# Altium project PCB_BobBreakout.PrjPcb
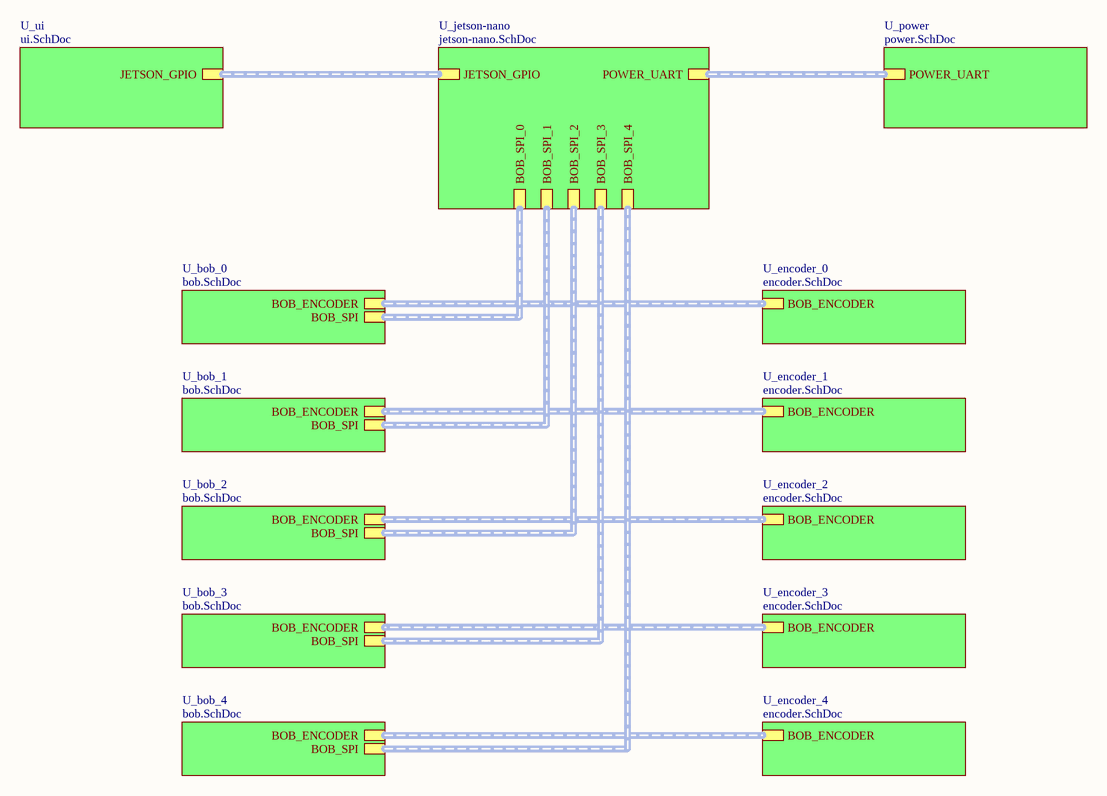
[diagram p0: bob_breakout-top.SchDoc]
8 sheets, 95 parts. Net scope: hierarchical (ports join the sheet entries above them; power ports are global).
Board file: layout.PcbDoc
Sheets:
  bob_breakout-top.SchDoc
    U_jetson-nano = jetson-nano.SchDoc
      U_isolation_0 = isolation.SchDoc
      U_isolation_1 = isolation.SchDoc
      U_isolation_2 = isolation.SchDoc
      U_low-pass-filter_0 = low-pass-filter.SchDoc
      U_low-pass-filter_1 = low-pass-filter.SchDoc
      U_low-pass-filter_2 = low-pass-filter.SchDoc
      U_low-pass-filter_3 = low-pass-filter.SchDoc
      U_low-pass-filter_4 = low-pass-filter.SchDoc
      U_low-pass-filter_5 = low-pass-filter.SchDoc
      U_low-pass-filter_6 = low-pass-filter.SchDoc
      U_low-pass-filter_7 = low-pass-filter.SchDoc
      U_low-pass-filter_8 = low-pass-filter.SchDoc
    U_bob_0 = bob.SchDoc
    U_bob_1 = bob.SchDoc
    U_bob_2 = bob.SchDoc
    U_bob_3 = bob.SchDoc
    U_bob_4 = bob.SchDoc
    U_encoder_0 = encoder.SchDoc
    U_encoder_1 = encoder.SchDoc
    U_encoder_2 = encoder.SchDoc
    U_encoder_3 = encoder.SchDoc
    U_encoder_4 = encoder.SchDoc
    U_power = power.SchDoc
    U_ui = ui.SchDoc

## Sheet bob_breakout-top.SchDoc
size A4; SheetNumber: 1; SheetTotal: 7

### Sub-sheets
U_bob_0 = bob.SchDoc: BOB_ENCODER (harness BOB_ENCODER), BOB_SPI (harness BOB_SPI)
U_bob_1 = bob.SchDoc: BOB_ENCODER (harness BOB_ENCODER), BOB_SPI (harness BOB_SPI)
U_bob_2 = bob.SchDoc: BOB_ENCODER (harness BOB_ENCODER), BOB_SPI (harness BOB_SPI)
U_bob_3 = bob.SchDoc: BOB_ENCODER (harness BOB_ENCODER), BOB_SPI (harness BOB_SPI)
U_bob_4 = bob.SchDoc: BOB_ENCODER (harness BOB_ENCODER), BOB_SPI (harness BOB_SPI)
U_encoder_0 = encoder.SchDoc: BOB_ENCODER (harness BOB_ENCODER)
U_encoder_1 = encoder.SchDoc: BOB_ENCODER (harness BOB_ENCODER)
U_encoder_2 = encoder.SchDoc: BOB_ENCODER (harness BOB_ENCODER)
U_encoder_3 = encoder.SchDoc: BOB_ENCODER (harness BOB_ENCODER)
U_encoder_4 = encoder.SchDoc: BOB_ENCODER (harness BOB_ENCODER)
U_jetson-nano = jetson-nano.SchDoc: BOB_SPI_2 (harness BOB_SPI), BOB_SPI_0 (harness BOB_SPI), BOB_SPI_4 (harness BOB_SPI), BOB_SPI_3 (harness BOB_SPI), BOB_SPI_1 (harness BOB_SPI), JETSON_GPIO (harness JETSON_GPIO), POWER_UART (harness POWER_UART)
U_power = power.SchDoc: POWER_UART (harness POWER_UART)
U_ui = ui.SchDoc: JETSON_GPIO (harness JETSON_GPIO)

### Buses and harness runs
harness sheet U_bob_0/BOB_ENCODER = sheet U_encoder_0/BOB_ENCODER
harness sheet U_bob_0/BOB_SPI = sheet U_jetson-nano/BOB_SPI_0
harness sheet U_bob_1/BOB_ENCODER = sheet U_encoder_1/BOB_ENCODER
harness sheet U_bob_1/BOB_SPI = sheet U_jetson-nano/BOB_SPI_1
harness sheet U_bob_2/BOB_ENCODER = sheet U_encoder_2/BOB_ENCODER
harness sheet U_bob_2/BOB_SPI = sheet U_jetson-nano/BOB_SPI_2
harness sheet U_bob_3/BOB_ENCODER = sheet U_encoder_3/BOB_ENCODER
harness sheet U_bob_3/BOB_SPI = sheet U_jetson-nano/BOB_SPI_3
harness sheet U_bob_4/BOB_ENCODER = sheet U_encoder_4/BOB_ENCODER
harness sheet U_bob_4/BOB_SPI = sheet U_jetson-nano/BOB_SPI_4
harness sheet U_jetson-nano/JETSON_GPIO = sheet U_ui/JETSON_GPIO
harness sheet U_jetson-nano/POWER_UART = sheet U_power/POWER_UART

## Sheet jetson-nano.SchDoc
size A3; SheetNumber: 2; SheetTotal: 8
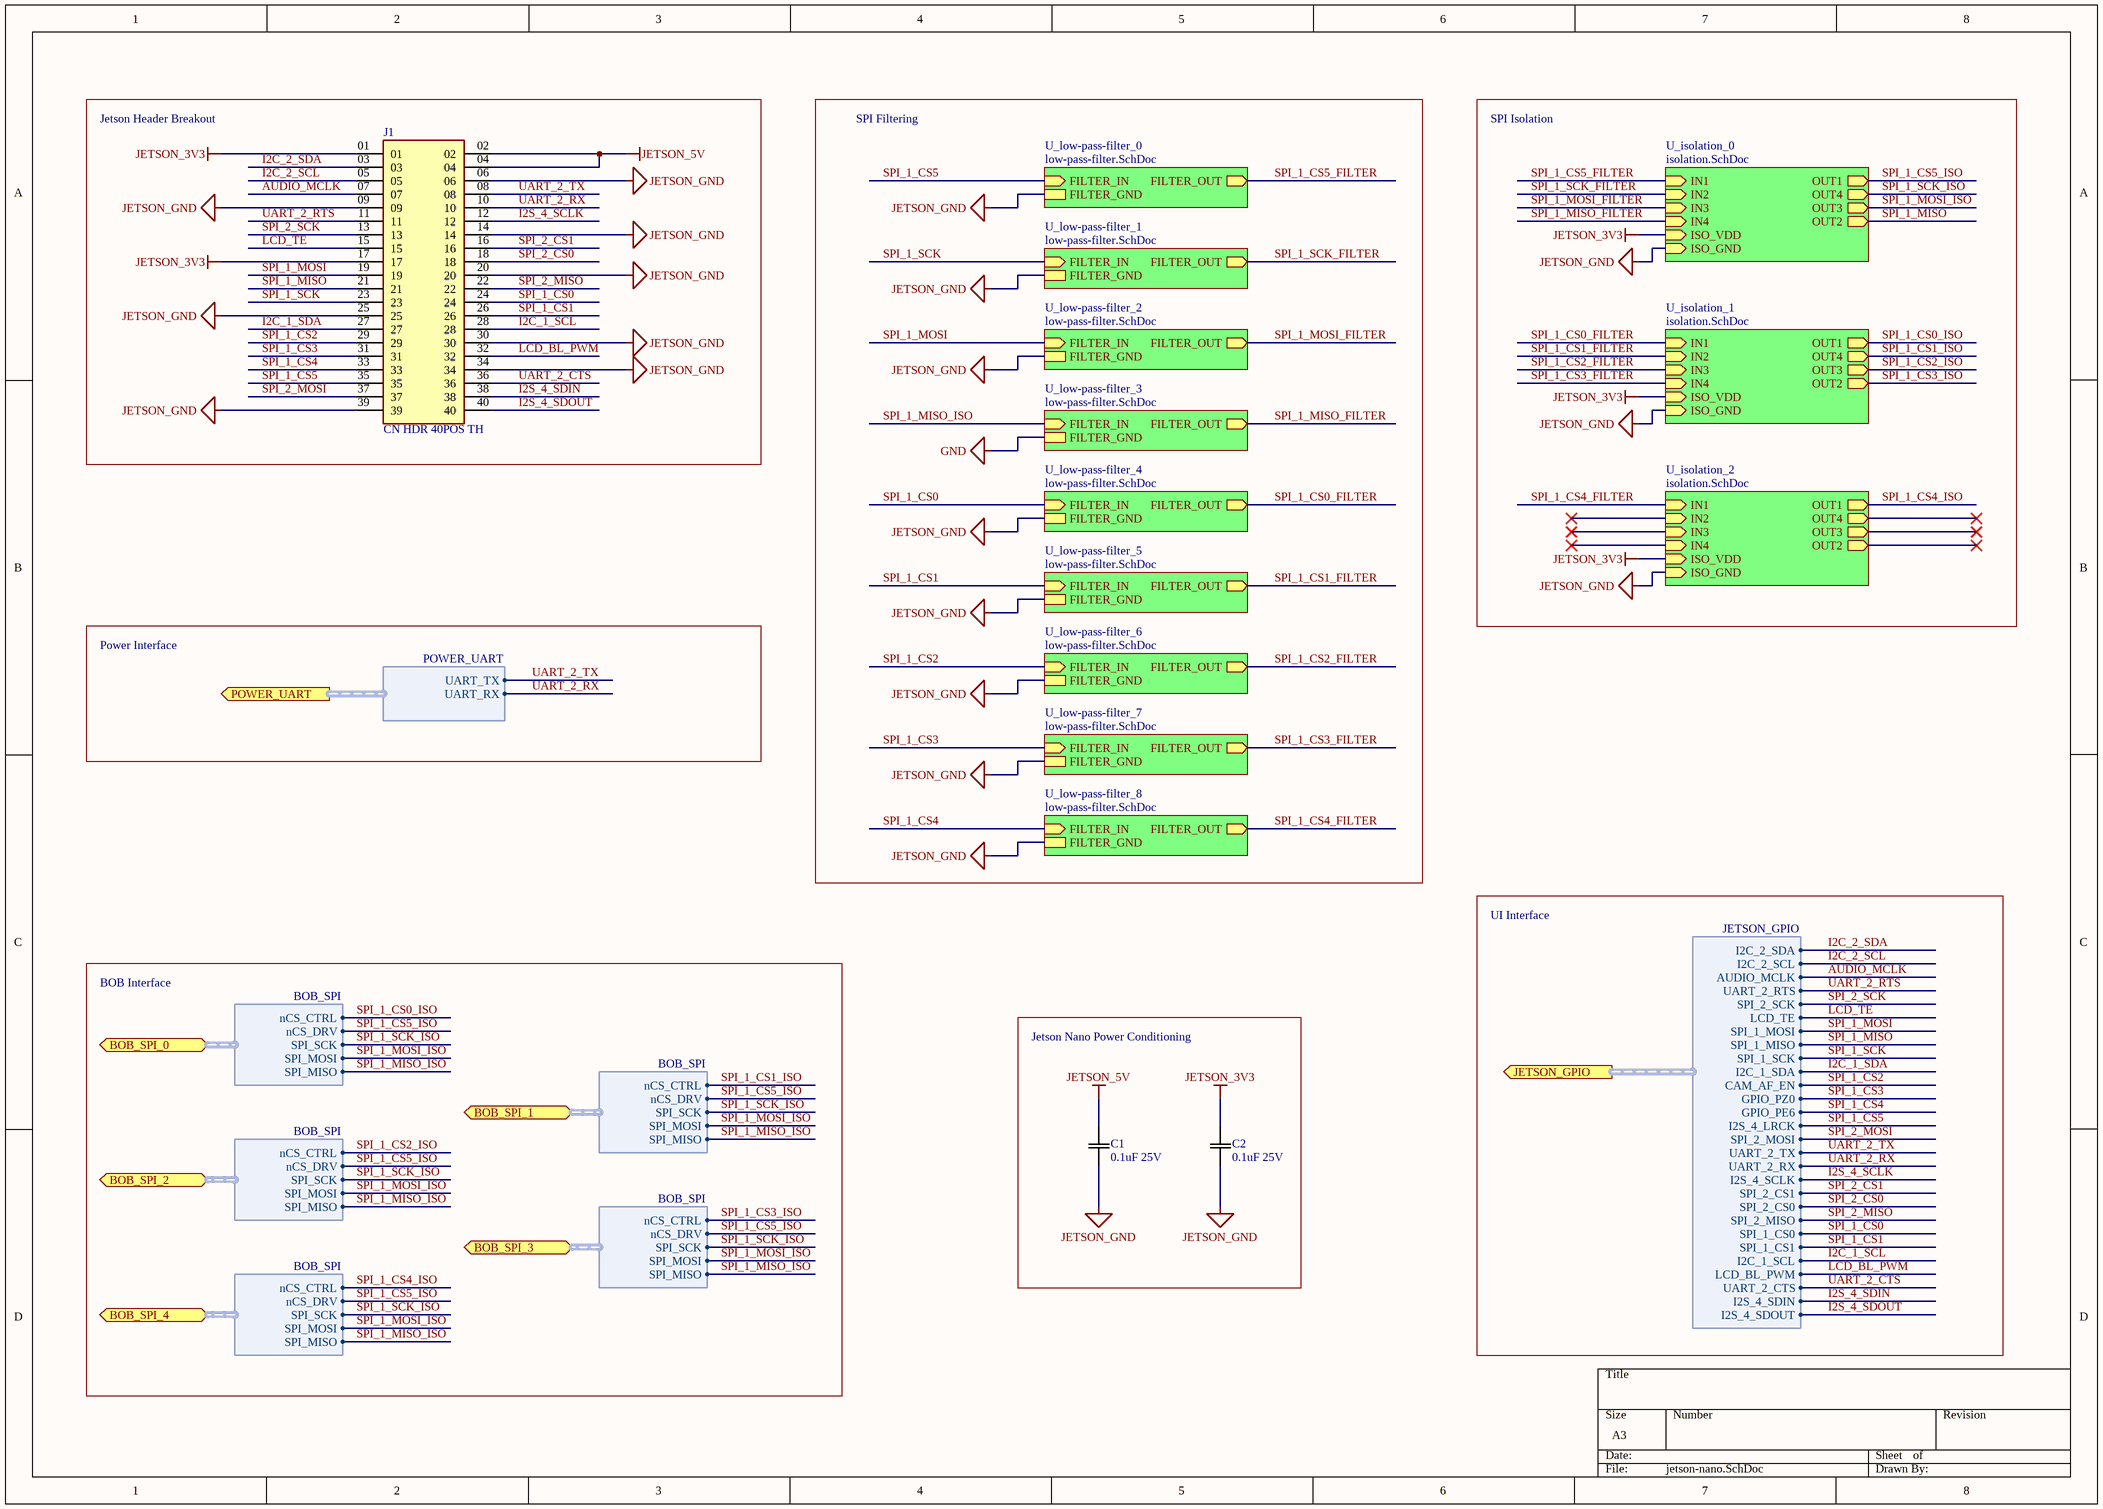
[diagram p1: jetson-nano.SchDoc]

### Parts
C1  0.1uF 25V  [0805]
C2  0.1uF 25V  [0805]
J1  CN HDR 40POS TH  [SAMTEC_SSQ-120-22-G-D]

### Blocks framed on the sheet
Jetson Header Breakout: J1
Jetson Nano Power Conditioning: C1 C2

### Sub-sheets
U_isolation_0 = isolation.SchDoc: OUT1 (out), IN1 (in), IN2 (in), IN3 (in), OUT4 (out), OUT3 (out), OUT2 (out), IN4 (in), ISO_VDD (in), ISO_GND (in)
U_isolation_1 = isolation.SchDoc: OUT1 (out), IN1 (in), IN2 (in), IN3 (in), OUT4 (out), OUT3 (out), OUT2 (out), IN4 (in), ISO_VDD (in), ISO_GND (in)
U_isolation_2 = isolation.SchDoc: OUT1 (out), IN1 (in), IN2 (in), IN3 (in), OUT4 (out), OUT3 (out), OUT2 (out), IN4 (in), ISO_VDD (in), ISO_GND (in)
U_low-pass-filter_0 = low-pass-filter.SchDoc: FILTER_OUT (out), FILTER_IN (in), FILTER_GND
U_low-pass-filter_1 = low-pass-filter.SchDoc: FILTER_OUT (out), FILTER_IN (in), FILTER_GND
U_low-pass-filter_2 = low-pass-filter.SchDoc: FILTER_OUT (out), FILTER_IN (in), FILTER_GND
U_low-pass-filter_3 = low-pass-filter.SchDoc: FILTER_OUT (out), FILTER_IN (in), FILTER_GND
U_low-pass-filter_4 = low-pass-filter.SchDoc: FILTER_OUT (out), FILTER_IN (in), FILTER_GND
U_low-pass-filter_5 = low-pass-filter.SchDoc: FILTER_OUT (out), FILTER_IN (in), FILTER_GND
U_low-pass-filter_6 = low-pass-filter.SchDoc: FILTER_OUT (out), FILTER_IN (in), FILTER_GND
U_low-pass-filter_7 = low-pass-filter.SchDoc: FILTER_OUT (out), FILTER_IN (in), FILTER_GND
U_low-pass-filter_8 = low-pass-filter.SchDoc: FILTER_OUT (out), FILTER_IN (in), FILTER_GND

### Ports
BOB_SPI_0 (bidir, harness BOB_SPI), BOB_SPI_1 (bidir, harness BOB_SPI), BOB_SPI_2 (bidir, harness BOB_SPI), BOB_SPI_3 (bidir, harness BOB_SPI), BOB_SPI_4 (bidir, harness BOB_SPI), JETSON_GPIO (out, harness JETSON_GPIO), POWER_UART (out, harness POWER_UART)

### Harnesses
BOB_SPI: nCS_CTRL, nCS_DRV, SPI_SCK, SPI_MOSI, SPI_MISO
POWER_UART: UART_TX, UART_RX
JETSON_GPIO: I2C_2_SDA, I2C_2_SCL, AUDIO_MCLK, UART_2_RTS, SPI_2_SCK, LCD_TE, SPI_1_MOSI, SPI_1_MISO, SPI_1_SCK, I2C_1_SDA, CAM_AF_EN, GPIO_PZ0, GPIO_PE6, I2S_4_LRCK, SPI_2_MOSI, UART_2_TX, UART_2_RX, I2S_4_SCLK, SPI_2_CS1, SPI_2_CS0, SPI_2_MISO, SPI_1_CS0, SPI_1_CS1, I2C_1_SCL, LCD_BL_PWM, UART_2_CTS, I2S_4_SDIN, I2S_4_SDOUT

### Nets
JETSON_3V3: C2.1(C1) J1.01 J1.17 ; sheet U_isolation_0/ISO_VDD, sheet U_isolation_1/ISO_VDD, sheet U_isolation_2/ISO_VDD
JETSON_5V: C1.1(C1) J1.02 J1.04
JETSON_GND: C1.2(C2) C2.2(C2) J1.06 J1.09 J1.14 J1.20 J1.25 J1.30 J1.34 J1.39 ; sheet U_isolation_0/ISO_GND, sheet U_isolation_1/ISO_GND, sheet U_isolation_2/ISO_GND, sheet U_low-pass-filter_0/FILTER_GND, sheet U_low-pass-filter_1/FILTER_GND, sheet U_low-pass-filter_2/FILTER_GND, sheet U_low-pass-filter_4/FILTER_GND, sheet U_low-pass-filter_5/FILTER_GND, sheet U_low-pass-filter_6/FILTER_GND, sheet U_low-pass-filter_7/FILTER_GND, sheet U_low-pass-filter_8/FILTER_GND
AUDIO_MCLK: J1.07 ; port JETSON_GPIO.AUDIO_MCLK
I2C_1_SCL: J1.28 ; port JETSON_GPIO.I2C_1_SCL
I2C_1_SDA: J1.27 ; port JETSON_GPIO.I2C_1_SDA
I2C_2_SCL: J1.05 ; port JETSON_GPIO.I2C_2_SCL
I2C_2_SDA: J1.03 ; port JETSON_GPIO.I2C_2_SDA
I2S_4_SCLK: J1.12 ; port JETSON_GPIO.I2S_4_SCLK
I2S_4_SDIN: J1.38 ; port JETSON_GPIO.I2S_4_SDIN
I2S_4_SDOUT: J1.40 ; port JETSON_GPIO.I2S_4_SDOUT
LCD_BL_PWM: J1.32 ; port JETSON_GPIO.LCD_BL_PWM
LCD_TE: J1.15 ; port JETSON_GPIO.LCD_TE
SPI_1_CS0: J1.24 ; sheet U_low-pass-filter_4/FILTER_IN, port JETSON_GPIO.SPI_1_CS0
SPI_1_CS0_FILTER: sheet U_isolation_1/IN1, sheet U_low-pass-filter_4/FILTER_OUT
SPI_1_CS0_ISO: sheet U_isolation_1/OUT1, port BOB_SPI_0.nCS_CTRL
SPI_1_CS1: J1.26 ; sheet U_low-pass-filter_5/FILTER_IN, port JETSON_GPIO.SPI_1_CS1
SPI_1_CS1_FILTER: sheet U_isolation_1/IN2, sheet U_low-pass-filter_5/FILTER_OUT
SPI_1_CS1_ISO: sheet U_isolation_1/OUT4, port BOB_SPI_1.nCS_CTRL
SPI_1_CS2: J1.29 ; sheet U_low-pass-filter_6/FILTER_IN, port JETSON_GPIO.CAM_AF_EN  [project net CAM_AF_EN]
SPI_1_CS2_FILTER: sheet U_isolation_1/IN3, sheet U_low-pass-filter_6/FILTER_OUT
SPI_1_CS2_ISO: sheet U_isolation_1/OUT3, port BOB_SPI_2.nCS_CTRL
SPI_1_CS3: J1.31 ; sheet U_low-pass-filter_7/FILTER_IN, port JETSON_GPIO.GPIO_PZ0  [project net GPIO_PZ0]
SPI_1_CS3_FILTER: sheet U_isolation_1/IN4, sheet U_low-pass-filter_7/FILTER_OUT
SPI_1_CS3_ISO: sheet U_isolation_1/OUT2, port BOB_SPI_3.nCS_CTRL
SPI_1_CS4: J1.33 ; sheet U_low-pass-filter_8/FILTER_IN, port JETSON_GPIO.GPIO_PE6  [project net GPIO_PE6]
SPI_1_CS4_FILTER: sheet U_isolation_2/IN1, sheet U_low-pass-filter_8/FILTER_OUT
SPI_1_CS4_ISO: sheet U_isolation_2/OUT1, port BOB_SPI_4.nCS_CTRL
SPI_1_CS5: J1.35 ; sheet U_low-pass-filter_0/FILTER_IN, port JETSON_GPIO.I2S_4_LRCK  [project net I2S_4_LRCK]
SPI_1_CS5_FILTER: sheet U_isolation_0/IN1, sheet U_low-pass-filter_0/FILTER_OUT
SPI_1_CS5_ISO: sheet U_isolation_0/OUT1, port BOB_SPI_0.nCS_DRV, port BOB_SPI_2.nCS_DRV, port BOB_SPI_1.nCS_DRV, port BOB_SPI_3.nCS_DRV, port BOB_SPI_4.nCS_DRV
SPI_1_MISO: J1.21 ; sheet U_isolation_0/OUT2, port JETSON_GPIO.SPI_1_MISO
SPI_1_MISO_FILTER: sheet U_isolation_0/IN4, sheet U_low-pass-filter_3/FILTER_OUT
SPI_1_MISO_ISO: sheet U_low-pass-filter_3/FILTER_IN, port BOB_SPI_0.SPI_MISO, port BOB_SPI_2.SPI_MISO, port BOB_SPI_1.SPI_MISO, port BOB_SPI_3.SPI_MISO, port BOB_SPI_4.SPI_MISO
SPI_1_MOSI: J1.19 ; sheet U_low-pass-filter_2/FILTER_IN, port JETSON_GPIO.SPI_1_MOSI
SPI_1_MOSI_FILTER: sheet U_isolation_0/IN3, sheet U_low-pass-filter_2/FILTER_OUT
SPI_1_MOSI_ISO: sheet U_isolation_0/OUT3, port BOB_SPI_0.SPI_MOSI, port BOB_SPI_2.SPI_MOSI, port BOB_SPI_1.SPI_MOSI, port BOB_SPI_3.SPI_MOSI, port BOB_SPI_4.SPI_MOSI
SPI_1_SCK: J1.23 ; sheet U_low-pass-filter_1/FILTER_IN, port JETSON_GPIO.SPI_1_SCK
SPI_1_SCK_FILTER: sheet U_isolation_0/IN2, sheet U_low-pass-filter_1/FILTER_OUT
SPI_1_SCK_ISO: sheet U_isolation_0/OUT4, port BOB_SPI_0.SPI_SCK, port BOB_SPI_2.SPI_SCK, port BOB_SPI_1.SPI_SCK, port BOB_SPI_3.SPI_SCK, port BOB_SPI_4.SPI_SCK
SPI_2_CS0: J1.18 ; port JETSON_GPIO.SPI_2_CS0
SPI_2_CS1: J1.16 ; port JETSON_GPIO.SPI_2_CS1
SPI_2_MISO: J1.22 ; port JETSON_GPIO.SPI_2_MISO
SPI_2_MOSI: J1.37 ; port JETSON_GPIO.SPI_2_MOSI
SPI_2_SCK: J1.13 ; port JETSON_GPIO.SPI_2_SCK
UART_2_CTS: J1.36 ; port JETSON_GPIO.UART_2_CTS
UART_2_RTS: J1.11 ; port JETSON_GPIO.UART_2_RTS
UART_2_RX: J1.10 ; port POWER_UART.UART_RX, port JETSON_GPIO.UART_2_RX
UART_2_TX: J1.08 ; port POWER_UART.UART_TX, port JETSON_GPIO.UART_2_TX

### Notes on the sheet
- SPI Filtering
- SPI Isolation
- Power Interface
- UI Interface
- BOB Interface

### Library data of the parts
C1 C2 = CAP 0.1uF 25V: CAP CER 0.1UF 25V X7R 0805/0603; Tolerance: 10%; Value: 0.1uF; Temperature Coefficient: X7R; Rating: 25V; Operating Temperature: -55°C ~ 125°C
J1 = CN HDR 40POS TH: SSQ - Samtec 2.54mm Square Tail Dual Row Socket Strip 8.5mm Profile; MP: SSQ-120-22-G-D; Value: *; Price: None; Package: None; MF: Samtec; Check_prices: https://www.snapeda.com/parts/SSQ-120-22-G-D/Samtec/view-part/3393219/?ref=eda; Availability: In Stock; SnapEDA_Link: https://www.snapeda.com/parts/SSQ-120-22-G-D/Samtec/view-part/3393219/?ref=snap; Purchase-URL: https://pricing.snapeda.com/search/part/SSQ-120-22-G-D/?ref=eda; Digikey: S6104-ND

## Sheet isolation.SchDoc
size A4; SheetNumber: 3; SheetTotal: 7
Used 3 times, as channels U_jetson-nano/U_isolation_0, U_jetson-nano/U_isolation_1, U_jetson-nano/U_isolation_2. Parts and nets are listed once, with the designators drawn on the sheet.
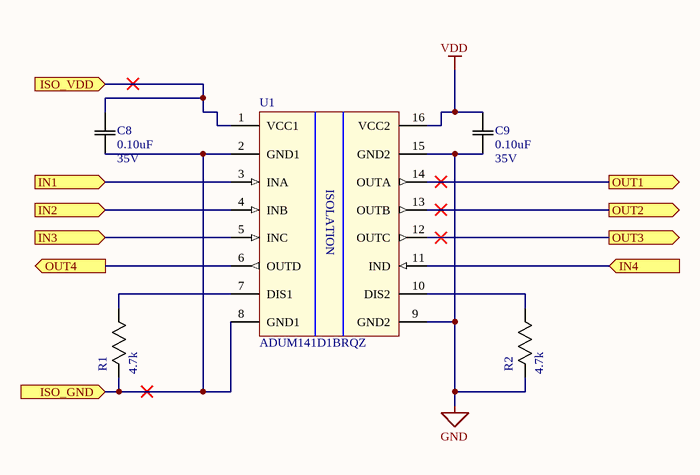
[diagram p2: isolation.SchDoc]

### Parts
C8  Rating: 35V  [0603]  (hidden comment: 0.10uF)
C9  Rating: 35V  [0603]  (hidden comment: 0.10uF)
R1  4.7k  [0603]
R2  4.7k  [0603]
U1  ADUM141D1BRQZ  [SOP64P600X175-16N]

### Ports
IN1 (in), IN2 (in), IN3 (in), IN4 (in), ISO_GND (in), ISO_VDD (in), OUT1 (out), OUT2 (out), OUT3 (out), OUT4 (out)

### Nets
GND: C9.1(C1) R2.2(R2) U1.9(GND2) U1.15(GND2)
VDD: C9.2(C2) U1.16(VCC2)
IN1: U1.3(INA) ; port IN1
IN2: U1.4(INB) ; port IN2
IN3: U1.5(INC) ; port IN3
IN4: U1.11(IND) ; port IN4
ISO_GND: C8.1(C1) R1.2(R2) U1.2(GND1) U1.8(GND1) ; port ISO_GND
ISO_VDD: C8.2(C2) U1.1(VCC1) ; port ISO_VDD
OUT1: U1.14(OUTA) ; port OUT1
OUT2: U1.13(OUTB) ; port OUT2
OUT3: U1.12(OUTC) ; port OUT3
OUT4: U1.6(OUTD) ; port OUT4
NetR1_1: R1.1(R1) U1.7(DIS1)
NetR2_1: R2.1(R1) U1.10(DIS2)

### Channels
U_jetson-nano/U_isolation_0: designators end in _U_isolation_0; ports IN1=SPI_1_CS5_FILTER IN2=SPI_1_SCK_FILTER IN3=SPI_1_MOSI_FILTER IN4=SPI_1_MISO_FILTER ISO_GND=JETSON_GND ISO_VDD=JETSON_3V3 OUT1=SPI_1_CS5_ISO OUT2=SPI_1_MISO OUT3=SPI_1_MOSI_ISO OUT4=SPI_1_SCK_ISO
U_jetson-nano/U_isolation_1: designators end in _U_isolation_1; ports IN1=SPI_1_CS0_FILTER IN2=SPI_1_CS1_FILTER IN3=SPI_1_CS2_FILTER IN4=SPI_1_CS3_FILTER ISO_GND=JETSON_GND ISO_VDD=JETSON_3V3 OUT1=SPI_1_CS0_ISO OUT2=SPI_1_CS3_ISO OUT3=SPI_1_CS2_ISO OUT4=SPI_1_CS1_ISO
U_jetson-nano/U_isolation_2: designators end in _U_isolation_2; ports IN1=SPI_1_CS4_FILTER IN2=NetU1_U_isolation_2_4 IN3=NetU1_U_isolation_2_5 IN4=NetU1_U_isolation_2_11 ISO_GND=JETSON_GND ISO_VDD=JETSON_3V3 OUT1=SPI_1_CS4_ISO OUT2=NetU1_U_isolation_2_13 OUT3=NetU1_U_isolation_2_12 OUT4=NetU1_U_isolation_2_6

### Notes on the sheet
- (in symbol ISO ADUM141D1BRQZ) ISOLATION

### Library data of the parts
C8 C9 = CAP 0.10uF 35V: CAP CER 0.10UF 35V X7R 0603/0805; Tolerance: 10%; Package: 0603/0805; Temperature Coefficient: X7R; Operating Temperature: -55°C ~ 125°C; Value: 0.10uF
R1 R2 = RES 4.7k 1/8W - 5%: RES SMD 4.7k OHM 5% 1/8W 0805; Power (Watts): 0.125W; Package: 0805; Value: 4.7k; Tolerance: 5%
U1 = ISO ADUM141D1BRQZ: DGTL ISO 3.75KV 4CH SPI 16SSOP 3/1

## Sheet low-pass-filter.SchDoc
size A4; SheetNumber: 8; SheetTotal: 8
Used 9 times, as channels U_jetson-nano/U_low-pass-filter_0, U_jetson-nano/U_low-pass-filter_1, U_jetson-nano/U_low-pass-filter_2, U_jetson-nano/U_low-pass-filter_3, U_jetson-nano/U_low-pass-filter_4, U_jetson-nano/U_low-pass-filter_5, U_jetson-nano/U_low-pass-filter_6, U_jetson-nano/U_low-pass-filter_7, U_jetson-nano/U_low-pass-filter_8. Parts and nets are listed once, with the designators drawn on the sheet.
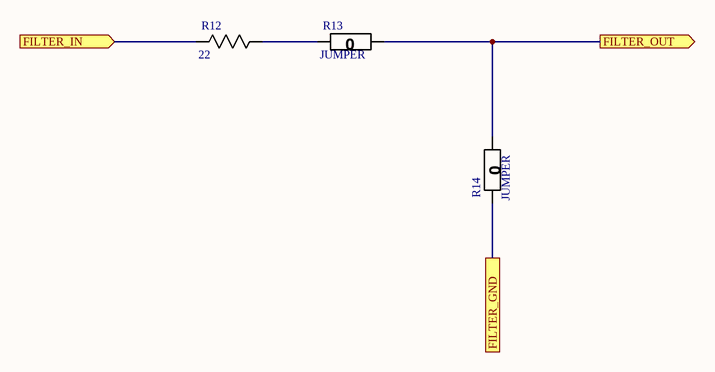
[diagram p3: low-pass-filter.SchDoc]

### Parts
R12  22  [0805]
R13  JUMPER  [0805]
R14  JUMPER  [0805]

### Ports
FILTER_GND, FILTER_IN (in), FILTER_OUT (out)

### Nets
FILTER_GND: R14.2(R2) ; port FILTER_GND
FILTER_IN: R12.2(R2) ; port FILTER_IN
FILTER_OUT: R13.1(R1) R14.1(R1) ; port FILTER_OUT
NetR12_1: R12.1(R1) R13.2(R2)

### Channels
U_jetson-nano/U_low-pass-filter_0: designators end in _U_low-pass-filter_0; ports FILTER_GND=JETSON_GND FILTER_IN=I2S_4_LRCK FILTER_OUT=SPI_1_CS5_FILTER
U_jetson-nano/U_low-pass-filter_1: designators end in _U_low-pass-filter_1; ports FILTER_GND=JETSON_GND FILTER_IN=SPI_1_SCK FILTER_OUT=SPI_1_SCK_FILTER
U_jetson-nano/U_low-pass-filter_2: designators end in _U_low-pass-filter_2; ports FILTER_GND=JETSON_GND FILTER_IN=SPI_1_MOSI FILTER_OUT=SPI_1_MOSI_FILTER
U_jetson-nano/U_low-pass-filter_3: designators end in _U_low-pass-filter_3; ports FILTER_GND=GND FILTER_IN=SPI_1_MISO_ISO FILTER_OUT=SPI_1_MISO_FILTER
U_jetson-nano/U_low-pass-filter_4: designators end in _U_low-pass-filter_4; ports FILTER_GND=JETSON_GND FILTER_IN=SPI_1_CS0 FILTER_OUT=SPI_1_CS0_FILTER
U_jetson-nano/U_low-pass-filter_5: designators end in _U_low-pass-filter_5; ports FILTER_GND=JETSON_GND FILTER_IN=SPI_1_CS1 FILTER_OUT=SPI_1_CS1_FILTER
U_jetson-nano/U_low-pass-filter_6: designators end in _U_low-pass-filter_6; ports FILTER_GND=JETSON_GND FILTER_IN=CAM_AF_EN FILTER_OUT=SPI_1_CS2_FILTER
U_jetson-nano/U_low-pass-filter_7: designators end in _U_low-pass-filter_7; ports FILTER_GND=JETSON_GND FILTER_IN=GPIO_PZ0 FILTER_OUT=SPI_1_CS3_FILTER
U_jetson-nano/U_low-pass-filter_8: designators end in _U_low-pass-filter_8; ports FILTER_GND=JETSON_GND FILTER_IN=GPIO_PE6 FILTER_OUT=SPI_1_CS4_FILTER

### Library data of the parts
R12 = RES 22.0 1/8W: RES SMD 22 OHM 5% 1/8W 0805; Power (Watts): 0.125W; Package: 0805; Value: 22; Tolerance: 5%
R13 R14 = RES 0 JUMPER: RES SMD 0 OHM JUMPER GENERIC 0805; Value: 0; Package: 0805

## Sheet bob.SchDoc
size A4; SheetNumber: 6; SheetTotal: 8
Used 5 times, as channels U_bob_0, U_bob_1, U_bob_2, U_bob_3, U_bob_4. Parts and nets are listed once, with the designators drawn on the sheet.
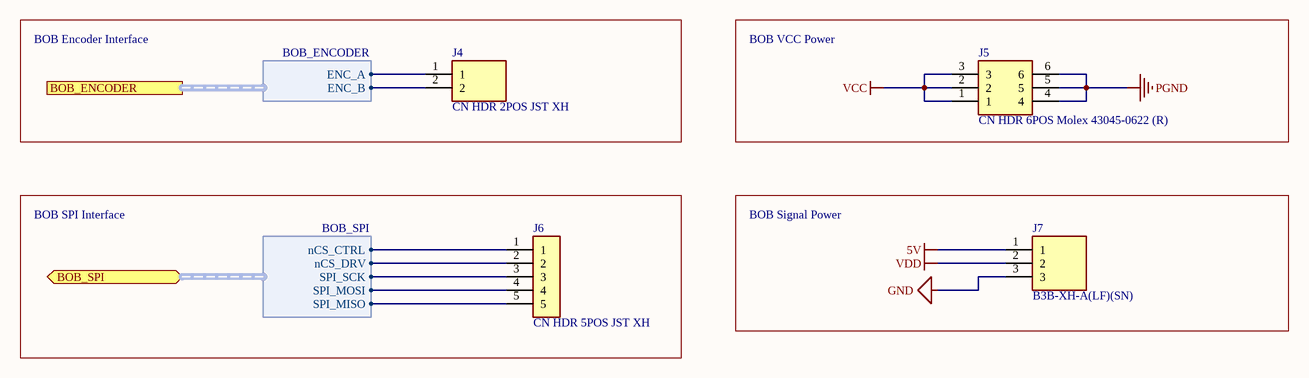
[diagram p4: bob.SchDoc]

### Parts
J4  CN HDR 2POS JST XH  [JST_B2B-XH-A(LF)(SN)]
J5  CN HDR 6POS Molex 43045-0622 (R)  [430450622]
J6  CN HDR 5POS JST XH  [JST_B5B-XH-A(LF)(SN)]
J7  B3B-XH-A(LF)(SN)  [JST_B3B-XH-A(LF)(SN)]

### Blocks framed on the sheet
BOB Encoder Interface: J4
BOB VCC Power: J5
BOB SPI Interface: J6
BOB Signal Power: J7

### Ports
BOB_ENCODER (harness BOB_ENCODER), BOB_SPI (bidir, harness BOB_SPI)

### Harnesses
BOB_ENCODER: ENC_A, ENC_B
BOB_SPI: nCS_CTRL, nCS_DRV, SPI_SCK, SPI_MOSI, SPI_MISO

### Nets
5V: J7.1
GND: J7.3
PGND: J5.4 J5.5 J5.6
VCC: J5.1 J5.2 J5.3
VDD: J7.2
NetJ4_1: J4.1 ; port BOB_ENCODER.ENC_A
NetJ4_2: J4.2 ; port BOB_ENCODER.ENC_B
NetJ6_1: J6.1 ; port BOB_SPI.nCS_CTRL
NetJ6_2: J6.2 ; port BOB_SPI.nCS_DRV
NetJ6_3: J6.3 ; port BOB_SPI.SPI_SCK
NetJ6_4: J6.4 ; port BOB_SPI.SPI_MOSI
NetJ6_5: J6.5 ; port BOB_SPI.SPI_MISO

### Channels
U_bob_0: designators end in _U_bob_0
U_bob_1: designators end in _U_bob_1
U_bob_2: designators end in _U_bob_2
U_bob_3: designators end in _U_bob_3
U_bob_4: designators end in _U_bob_4

### Library data of the parts
J4 = CN HDR 2POS JST XH: Connector Header Through Hole 2 position 0.098 _2.50mm_ / JST XH; MP: B2B-XH-A_LF__SN_; MF: JST Sales; Price: None; Package: None; Value: *; Availability: Unavailable; SnapEDA_Link: https://www.snapeda.com/parts/B2B-XH-A%28LF%29%28SN%29/JST%20Sales%20America%20Inc./view-part/492310/?ref=snap
J5 = CN HDR 6POS Molex 43045-0622 (R): Molex 43045-0622 6POS Microfit / dual row, right angle
J6 = CN HDR 5POS JST XH: Connector Header Through Hole 5 position 0.098" (2.50mm); MP: B5B-XH-A(LF)(SN); MF: JST Sales; Price: None; Package: None; Value: *; Availability: Unavailable; Digikey: 455-2270-ND; ComponentLink1Description: Digikey; ComponentLink1URL: https://www.digikey.ca/en/products/detail/jst-sales-america-inc/B5B-XH-A-LF-SN/1530483
J7 = CN 3POS TH JSTXH: CN 3POS TH JST XH; MF: JST Sales; Package: None; SnapEDA_Link: https://www.snapeda.com/parts/B3B-XH-A(LF)(SN)/JST%20Sales%20America%20Inc./view-part/231271/?ref=snap; DigiKey-Purchase-URL: https://snapeda.com/shop?store=DigiKey&id=231271; MP: B3B-XH-A(LF)(SN); Price: None; Availability: Warning; Value: *

## Sheet encoder.SchDoc
size A4; SheetNumber: 6; SheetTotal: 7
Used 5 times, as channels U_encoder_0, U_encoder_1, U_encoder_2, U_encoder_3, U_encoder_4. Parts and nets are listed once, with the designators drawn on the sheet.
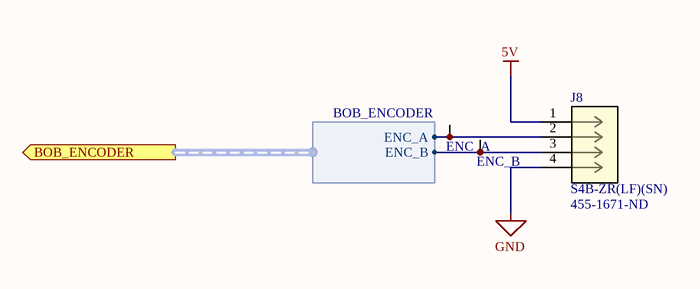
[diagram p5: encoder.SchDoc]

### Parts
ENC_A  Test Point (Via)  [TP]  (value not drawn)
ENC_B  Test Point (Via)  [TP]  (value not drawn)
J8  S4B-ZR(LF)(SN)  Supplier Part Number 1: 455-1671-ND  [CN S4B-ZR(LF)(SN)_JST]

### Ports
BOB_ENCODER (out, harness BOB_ENCODER)

### Harnesses
BOB_ENCODER: ENC_A, ENC_B

### Nets
5V: J8.1
GND: J8.4
NetENC_A_1: ENC_A.1 J8.2 ; port BOB_ENCODER.ENC_A
NetENC_B_1: ENC_B.1 J8.3 ; port BOB_ENCODER.ENC_B

### Channels
U_encoder_0: designators end in _U_encoder_0
U_encoder_1: designators end in _U_encoder_1
U_encoder_2: designators end in _U_encoder_2
U_encoder_3: designators end in _U_encoder_3
U_encoder_4: designators end in _U_encoder_4

### Library data of the parts
J8 = CN HDR 4POS JST ZR: Connector Header Through Hole, Right Angle 4 position 0.059" (1.50mm); Mfr_Name: JST; Copyright: Copyright (C) 2021 Ultra Librarian. All rights reserved.; Manufacturer_Part_Number: S4B-ZR(LF)(SN); Digi-Key_Part_Number_1: 455-1671-ND; RefDes: RefDes; Type: DEV; Supplier 1: Digi-Key

## Sheet power.SchDoc
size A4; SheetNumber: 4; SheetTotal: 7
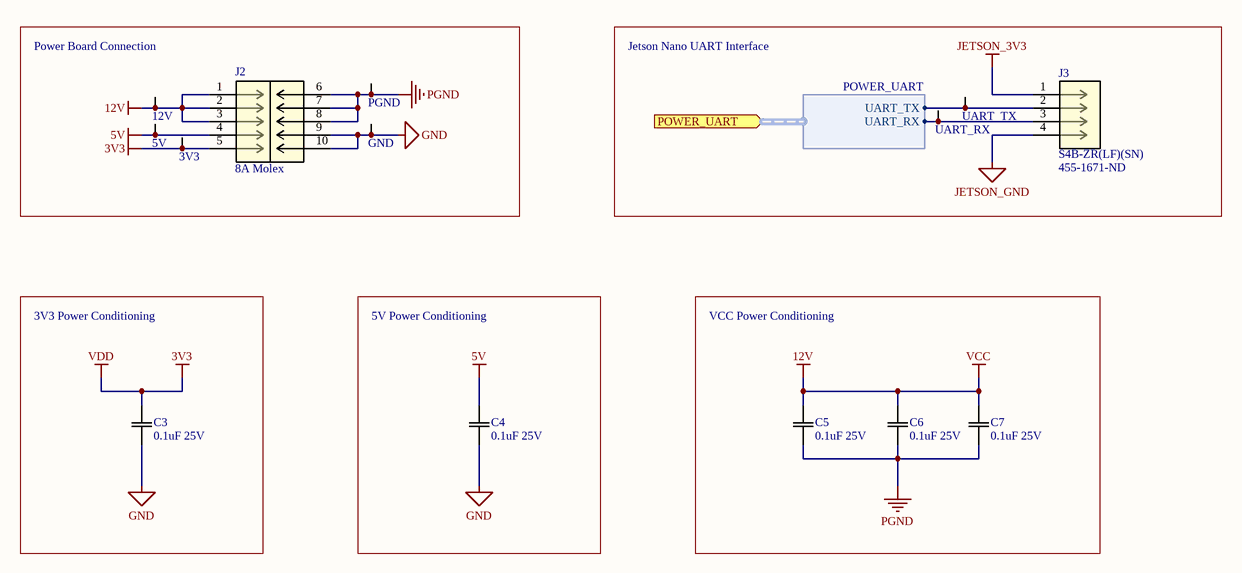
[diagram p6: power.SchDoc]

### Parts
3V3  Test Point (Via)  [TP]  (value not drawn)
5V  Test Point (Via)  [TP]  (value not drawn)
12V  Test Point (Via)  [TP]  (value not drawn)
C3  0.1uF 25V  [0805]
C4  0.1uF 25V  [0805]
C5  0.1uF 25V  [0805]
C6  0.1uF 25V  [0805]
C7  0.1uF 25V  [0805]
GND  Test Point (Via)  [TP]  (value not drawn)
J2  8A Molex  [MOLEX_0430451012]
J3  S4B-ZR(LF)(SN)  Supplier Part Number 1: 455-1671-ND  [CN S4B-ZR(LF)(SN)_JST]
PGND  Test Point (Via)  [TP]  (value not drawn)
UART_RX  Test Point (Via)  [TP]  (value not drawn)
UART_TX  Test Point (Via)  [TP]  (value not drawn)

### Blocks framed on the sheet
Power Board Connection: 3V3 5V 12V GND J2 PGND
Jetson Nano UART Interface: J3 UART_RX UART_TX
3V3 Power Conditioning: C3
5V Power Conditioning: C4
VCC Power Conditioning: C5-C7

### Ports
POWER_UART (in, harness POWER_UART)

### Harnesses
POWER_UART: UART_TX, UART_RX

### Nets
3V3: 3V3.1 C3.1(C1) J2.5  [also labelled VDD]
5V: 5V.1 C4.1(C1) J2.4
12V: 12V.1 C5.1(C1) C6.1(C1) C7.1(C1) J2.1 J2.2 J2.3  [also labelled VCC]
GND: C3.2(C2) C4.2(C2) GND.1 J2.9 J2.10
JETSON_3V3: J3.1
JETSON_GND: J3.4
PGND: C5.2(C2) C6.2(C2) C7.2(C2) J2.6 J2.7 J2.8 PGND.1
UART_2_RX: J3.3 UART_RX.1 ; port POWER_UART.UART_RX
UART_2_TX: J3.2 UART_TX.1 ; port POWER_UART.UART_TX

### Library data of the parts
C3-C7 = CAP 0.1uF 25V: as C1 on sheet jetson-nano; Value: 0.1uF; Temperature Coefficient: X7R; Rating: 25V; Operating Temperature: -55°C ~ 125°C
J2 = CN HDR 10POS MOLEX 0430451012: CONN HEADER VERT 10POS 3MM; Number of Terminals/Pins: 10; Contact Resistance: 10mR; Connector Type: Male Pin; Number of Ports: 1; Max Voltage Rating (AC): 250V; Pitch: 0.118inch; Supplier 1: Digi-Key; Manufacturer: Molex; Manufacturer Part Number: 0430451012; RoHS: Yes; Category: Headers and Wire Housings; Stock 1: 22123; Pricing 1: 1=2.46000, 10=2.09300, 80=1.72925, 1224=1.36521, 6120=1.21049 (USD); Mount: Through Hole; Color: Black; Contact Material: Brass; Contact Plating: Tin; Housing Color: Black; Housing Material: Polymer; Min Operating Temperature: -40°C; Max Operating Temperature: 105°C; Packaging: Tray; Number of Rows: 2; Number of Positions: 10; Termination: Solder; Number of Contacts: 10; Orientation: Straight; Series: Micro-Fit 3.0™ 43045; Fastening Type: Ramp; Contact Type: Male Pin; Length: 19.15mm; Row Spacing: 0.118inch; Depth: 8.77mm; Flammability Rating: UL94 V-0; RoHS Compliant: Yes; ComponentLink1URL: http://components.arrow.com/part/dataview/0323_01052363?src-supplier=Arrow+Europe; ComponentLink1Description: http://components.arrow.com/part/dataview/0323_01052363?src-supplier=Arrow+Europe; ComponentLink2URL: http://components.arrow.com/part/dataview/2943140S3689940N3303?src-supplier=Arrow+Electronics; ComponentLink2Description: http://components.arrow.com/part/dataview/2943140S3689940N3303?src-supplier=Arrow+Electronics; Supplier Part Number 1: WM1793-ND
J3 = CN HDR 4POS JST ZR: as J8 on sheet encoder; Copyright: Copyright (C) 2021 Ultra Librarian. All rights reserved.; Manufacturer_Part_Number: S4B-ZR(LF)(SN); Digi-Key_Part_Number_1: 455-1671-ND; RefDes: RefDes; Type: DEV; Supplier 1: Digi-Key

## Sheet ui.SchDoc
size A4; SheetNumber: 7; SheetTotal: 7
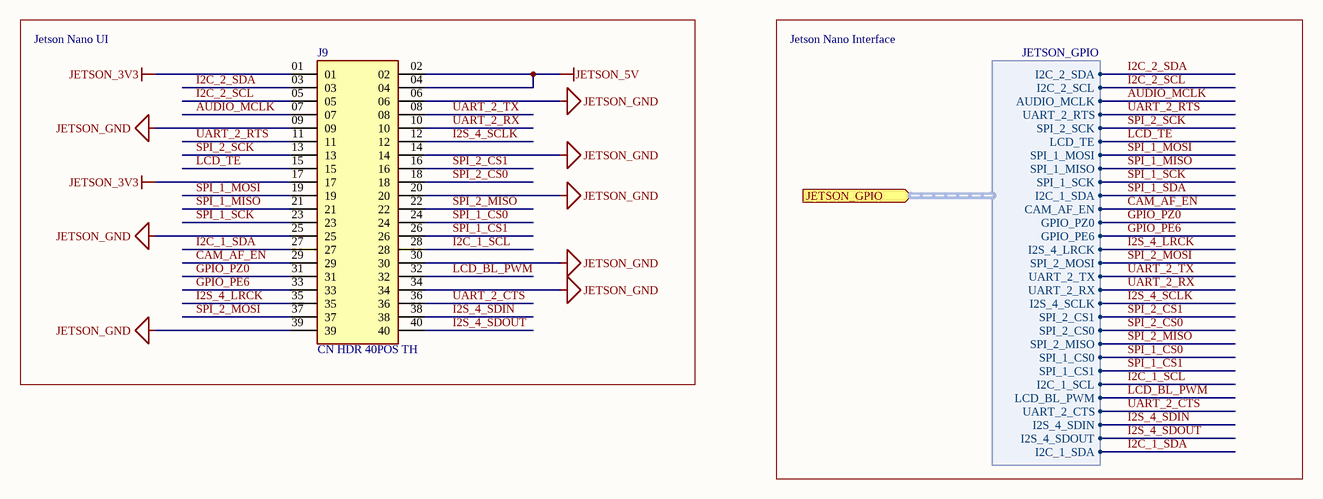
[diagram p7: ui.SchDoc]

### Parts
J9  CN HDR 40POS TH  [SAMTEC_SSQ-120-22-G-D]

### Blocks framed on the sheet
Jetson Nano UI: J9

### Ports
JETSON_GPIO (in, harness JETSON_GPIO)

### Harnesses
JETSON_GPIO: I2C_2_SDA, I2C_2_SCL, AUDIO_MCLK, UART_2_RTS, SPI_2_SCK, LCD_TE, SPI_1_MOSI, SPI_1_MISO, SPI_1_SCK, I2C_1_SDA, CAM_AF_EN, GPIO_PZ0, GPIO_PE6, I2S_4_LRCK, SPI_2_MOSI, UART_2_TX, UART_2_RX, I2S_4_SCLK, SPI_2_CS1, SPI_2_CS0, SPI_2_MISO, SPI_1_CS0, SPI_1_CS1, I2C_1_SCL, LCD_BL_PWM, UART_2_CTS, I2S_4_SDIN, I2S_4_SDOUT, I2C_1_SDA

### Nets
JETSON_3V3: J9.01 J9.17
JETSON_5V: J9.02 J9.04
JETSON_GND: J9.06 J9.09 J9.14 J9.20 J9.25 J9.30 J9.34 J9.39
AUDIO_MCLK: J9.07 ; port JETSON_GPIO.AUDIO_MCLK
CAM_AF_EN: J9.29 ; port JETSON_GPIO.CAM_AF_EN
GPIO_PE6: J9.33 ; port JETSON_GPIO.GPIO_PE6
GPIO_PZ0: J9.31 ; port JETSON_GPIO.GPIO_PZ0
I2C_1_SCL: J9.28 ; port JETSON_GPIO.I2C_1_SCL
I2C_1_SDA: J9.27 ; port JETSON_GPIO.I2C_1_SDA  [also labelled SPI_1_SDA]
I2C_2_SCL: J9.05 ; port JETSON_GPIO.I2C_2_SCL
I2C_2_SDA: J9.03 ; port JETSON_GPIO.I2C_2_SDA
I2S_4_LRCK: J9.35 ; port JETSON_GPIO.I2S_4_LRCK
I2S_4_SCLK: J9.12 ; port JETSON_GPIO.I2S_4_SCLK
I2S_4_SDIN: J9.38 ; port JETSON_GPIO.I2S_4_SDIN
I2S_4_SDOUT: J9.40 ; port JETSON_GPIO.I2S_4_SDOUT
LCD_BL_PWM: J9.32 ; port JETSON_GPIO.LCD_BL_PWM
LCD_TE: J9.15 ; port JETSON_GPIO.LCD_TE
SPI_1_CS0: J9.24 ; port JETSON_GPIO.SPI_1_CS0
SPI_1_CS1: J9.26 ; port JETSON_GPIO.SPI_1_CS1
SPI_1_MISO: J9.21 ; port JETSON_GPIO.SPI_1_MISO
SPI_1_MOSI: J9.19 ; port JETSON_GPIO.SPI_1_MOSI
SPI_1_SCK: J9.23 ; port JETSON_GPIO.SPI_1_SCK
SPI_2_CS0: J9.18 ; port JETSON_GPIO.SPI_2_CS0
SPI_2_CS1: J9.16 ; port JETSON_GPIO.SPI_2_CS1
SPI_2_MISO: J9.22 ; port JETSON_GPIO.SPI_2_MISO
SPI_2_MOSI: J9.37 ; port JETSON_GPIO.SPI_2_MOSI
SPI_2_SCK: J9.13 ; port JETSON_GPIO.SPI_2_SCK
UART_2_CTS: J9.36 ; port JETSON_GPIO.UART_2_CTS
UART_2_RTS: J9.11 ; port JETSON_GPIO.UART_2_RTS
UART_2_RX: J9.10 ; port JETSON_GPIO.UART_2_RX
UART_2_TX: J9.08 ; port JETSON_GPIO.UART_2_TX

### Notes on the sheet
- Jetson Nano Interface

### Library data of the parts
J9 = CN HDR 40POS TH: as J1 on sheet jetson-nano; Value: *; Price: None; Package: None; MF: Samtec; Check_prices: https://www.snapeda.com/parts/SSQ-120-22-G-D/Samtec/view-part/3393219/?ref=eda; Availability: In Stock; SnapEDA_Link: https://www.snapeda.com/parts/SSQ-120-22-G-D/Samtec/view-part/3393219/?ref=snap; Purchase-URL: https://pricing.snapeda.com/search/part/SSQ-120-22-G-D/?ref=eda; Digikey: S6104-ND

## Nets that join several sheets
3V3: U_jetson-nano/U_isolation_0 (C9_U_isolation_0.2 U1_U_isolation_0.16), U_jetson-nano/U_isolation_1 (C9_U_isolation_1.2 U1_U_isolation_1.16), U_jetson-nano/U_isolation_2 (C9_U_isolation_2.2 U1_U_isolation_2.16), U_bob_0 (J7_U_bob_0.2), U_bob_1 (J7_U_bob_1.2), U_bob_2 (J7_U_bob_2.2), U_bob_3 (J7_U_bob_3.2), U_bob_4 (J7_U_bob_4.2), power (3V3.1 C3.1 J2.5)
5V: U_bob_0 (J7_U_bob_0.1), U_bob_1 (J7_U_bob_1.1), U_bob_2 (J7_U_bob_2.1), U_bob_3 (J7_U_bob_3.1), U_bob_4 (J7_U_bob_4.1), U_encoder_0 (J8_U_encoder_0.1), U_encoder_1 (J8_U_encoder_1.1), U_encoder_2 (J8_U_encoder_2.1), U_encoder_3 (J8_U_encoder_3.1), U_encoder_4 (J8_U_encoder_4.1), power (5V.1 C4.1 J2.4)
12V: U_bob_0 (J5_U_bob_0.1 J5_U_bob_0.2 J5_U_bob_0.3), U_bob_1 (J5_U_bob_1.1 J5_U_bob_1.2 J5_U_bob_1.3), U_bob_2 (J5_U_bob_2.1 J5_U_bob_2.2 J5_U_bob_2.3), U_bob_3 (J5_U_bob_3.1 J5_U_bob_3.2 J5_U_bob_3.3), U_bob_4 (J5_U_bob_4.1 J5_U_bob_4.2 J5_U_bob_4.3), power (7 pins)
GND: U_jetson-nano/U_isolation_0 (C9_U_isolation_0.1 R2_U_isolation_0.2 U1_U_isolation_0.9 U1_U_isolation_0.15), U_jetson-nano/U_isolation_1 (C9_U_isolation_1.1 R2_U_isolation_1.2 U1_U_isolation_1.9 U1_U_isolation_1.15), U_jetson-nano/U_isolation_2 (C9_U_isolation_2.1 R2_U_isolation_2.2 U1_U_isolation_2.9 U1_U_isolation_2.15), U_jetson-nano/U_low-pass-filter_3 (R14_U_low-pass-filter_3.2), U_bob_0 (J7_U_bob_0.3), U_bob_1 (J7_U_bob_1.3), U_bob_2 (J7_U_bob_2.3), U_bob_3 (J7_U_bob_3.3), U_bob_4 (J7_U_bob_4.3), U_encoder_0 (J8_U_encoder_0.4), U_encoder_1 (J8_U_encoder_1.4), U_encoder_2 (J8_U_encoder_2.4), U_encoder_3 (J8_U_encoder_3.4), U_encoder_4 (J8_U_encoder_4.4), power (5 pins)
JETSON_3V3: jetson-nano (C2.1 J1.01 J1.17), U_jetson-nano/U_isolation_0 (C8_U_isolation_0.2 U1_U_isolation_0.1), U_jetson-nano/U_isolation_1 (C8_U_isolation_1.2 U1_U_isolation_1.1), U_jetson-nano/U_isolation_2 (C8_U_isolation_2.2 U1_U_isolation_2.1), power (J3.1), ui (J9.01 J9.17)
JETSON_5V: jetson-nano (C1.1 J1.02 J1.04), ui (J9.02 J9.04)
JETSON_GND: jetson-nano (10 pins), U_jetson-nano/U_isolation_0 (C8_U_isolation_0.1 R1_U_isolation_0.2 U1_U_isolation_0.2 U1_U_isolation_0.8), U_jetson-nano/U_isolation_1 (C8_U_isolation_1.1 R1_U_isolation_1.2 U1_U_isolation_1.2 U1_U_isolation_1.8), U_jetson-nano/U_isolation_2 (C8_U_isolation_2.1 R1_U_isolation_2.2 U1_U_isolation_2.2 U1_U_isolation_2.8), U_jetson-nano/U_low-pass-filter_0 (R14_U_low-pass-filter_0.2), U_jetson-nano/U_low-pass-filter_1 (R14_U_low-pass-filter_1.2), U_jetson-nano/U_low-pass-filter_2 (R14_U_low-pass-filter_2.2), U_jetson-nano/U_low-pass-filter_4 (R14_U_low-pass-filter_4.2), U_jetson-nano/U_low-pass-filter_5 (R14_U_low-pass-filter_5.2), U_jetson-nano/U_low-pass-filter_6 (R14_U_low-pass-filter_6.2), U_jetson-nano/U_low-pass-filter_7 (R14_U_low-pass-filter_7.2), U_jetson-nano/U_low-pass-filter_8 (R14_U_low-pass-filter_8.2), power (J3.4), ui (8 pins)
PGND: U_bob_0 (J5_U_bob_0.4 J5_U_bob_0.5 J5_U_bob_0.6), U_bob_1 (J5_U_bob_1.4 J5_U_bob_1.5 J5_U_bob_1.6), U_bob_2 (J5_U_bob_2.4 J5_U_bob_2.5 J5_U_bob_2.6), U_bob_3 (J5_U_bob_3.4 J5_U_bob_3.5 J5_U_bob_3.6), U_bob_4 (J5_U_bob_4.4 J5_U_bob_4.5 J5_U_bob_4.6), power (7 pins)
AUDIO_MCLK: jetson-nano (J1.07), ui (J9.07)
CAM_AF_EN: jetson-nano (J1.29), U_jetson-nano/U_low-pass-filter_6 (R12_U_low-pass-filter_6.2), ui (J9.29)
GPIO_PE6: jetson-nano (J1.33), U_jetson-nano/U_low-pass-filter_8 (R12_U_low-pass-filter_8.2), ui (J9.33)
GPIO_PZ0: jetson-nano (J1.31), U_jetson-nano/U_low-pass-filter_7 (R12_U_low-pass-filter_7.2), ui (J9.31)
I2C_1_SCL: jetson-nano (J1.28), ui (J9.28)
I2C_1_SDA: jetson-nano (J1.27), ui (J9.27)
I2C_2_SCL: jetson-nano (J1.05), ui (J9.05)
I2C_2_SDA: jetson-nano (J1.03), ui (J9.03)
I2S_4_LRCK: jetson-nano (J1.35), U_jetson-nano/U_low-pass-filter_0 (R12_U_low-pass-filter_0.2), ui (J9.35)
I2S_4_SCLK: jetson-nano (J1.12), ui (J9.12)
I2S_4_SDIN: jetson-nano (J1.38), ui (J9.38)
I2S_4_SDOUT: jetson-nano (J1.40), ui (J9.40)
LCD_BL_PWM: jetson-nano (J1.32), ui (J9.32)
LCD_TE: jetson-nano (J1.15), ui (J9.15)
NetENC_A_U_encoder_0_1: U_bob_0 (J4_U_bob_0.1), U_encoder_0 (ENC_A_U_encoder_0.1 J8_U_encoder_0.2)
NetENC_A_U_encoder_1_1: U_bob_1 (J4_U_bob_1.1), U_encoder_1 (ENC_A_U_encoder_1.1 J8_U_encoder_1.2)
NetENC_A_U_encoder_2_1: U_bob_2 (J4_U_bob_2.1), U_encoder_2 (ENC_A_U_encoder_2.1 J8_U_encoder_2.2)
NetENC_A_U_encoder_3_1: U_bob_3 (J4_U_bob_3.1), U_encoder_3 (ENC_A_U_encoder_3.1 J8_U_encoder_3.2)
NetENC_A_U_encoder_4_1: U_bob_4 (J4_U_bob_4.1), U_encoder_4 (ENC_A_U_encoder_4.1 J8_U_encoder_4.2)
NetENC_B_U_encoder_0_1: U_bob_0 (J4_U_bob_0.2), U_encoder_0 (ENC_B_U_encoder_0.1 J8_U_encoder_0.3)
NetENC_B_U_encoder_1_1: U_bob_1 (J4_U_bob_1.2), U_encoder_1 (ENC_B_U_encoder_1.1 J8_U_encoder_1.3)
NetENC_B_U_encoder_2_1: U_bob_2 (J4_U_bob_2.2), U_encoder_2 (ENC_B_U_encoder_2.1 J8_U_encoder_2.3)
NetENC_B_U_encoder_3_1: U_bob_3 (J4_U_bob_3.2), U_encoder_3 (ENC_B_U_encoder_3.1 J8_U_encoder_3.3)
NetENC_B_U_encoder_4_1: U_bob_4 (J4_U_bob_4.2), U_encoder_4 (ENC_B_U_encoder_4.1 J8_U_encoder_4.3)
SPI_1_CS0: jetson-nano (J1.24), U_jetson-nano/U_low-pass-filter_4 (R12_U_low-pass-filter_4.2), ui (J9.24)
SPI_1_CS0_FILTER: U_jetson-nano/U_isolation_1 (U1_U_isolation_1.3), U_jetson-nano/U_low-pass-filter_4 (R13_U_low-pass-filter_4.1 R14_U_low-pass-filter_4.1)
SPI_1_CS0_ISO: U_jetson-nano/U_isolation_1 (U1_U_isolation_1.14), U_bob_0 (J6_U_bob_0.1)
SPI_1_CS1: jetson-nano (J1.26), U_jetson-nano/U_low-pass-filter_5 (R12_U_low-pass-filter_5.2), ui (J9.26)
SPI_1_CS1_FILTER: U_jetson-nano/U_isolation_1 (U1_U_isolation_1.4), U_jetson-nano/U_low-pass-filter_5 (R13_U_low-pass-filter_5.1 R14_U_low-pass-filter_5.1)
SPI_1_CS1_ISO: U_jetson-nano/U_isolation_1 (U1_U_isolation_1.6), U_bob_1 (J6_U_bob_1.1)
SPI_1_CS2_FILTER: U_jetson-nano/U_isolation_1 (U1_U_isolation_1.5), U_jetson-nano/U_low-pass-filter_6 (R13_U_low-pass-filter_6.1 R14_U_low-pass-filter_6.1)
SPI_1_CS2_ISO: U_jetson-nano/U_isolation_1 (U1_U_isolation_1.12), U_bob_2 (J6_U_bob_2.1)
SPI_1_CS3_FILTER: U_jetson-nano/U_isolation_1 (U1_U_isolation_1.11), U_jetson-nano/U_low-pass-filter_7 (R13_U_low-pass-filter_7.1 R14_U_low-pass-filter_7.1)
SPI_1_CS3_ISO: U_jetson-nano/U_isolation_1 (U1_U_isolation_1.13), U_bob_3 (J6_U_bob_3.1)
SPI_1_CS4_FILTER: U_jetson-nano/U_isolation_2 (U1_U_isolation_2.3), U_jetson-nano/U_low-pass-filter_8 (R13_U_low-pass-filter_8.1 R14_U_low-pass-filter_8.1)
SPI_1_CS4_ISO: U_jetson-nano/U_isolation_2 (U1_U_isolation_2.14), U_bob_4 (J6_U_bob_4.1)
SPI_1_CS5_FILTER: U_jetson-nano/U_isolation_0 (U1_U_isolation_0.3), U_jetson-nano/U_low-pass-filter_0 (R13_U_low-pass-filter_0.1 R14_U_low-pass-filter_0.1)
SPI_1_CS5_ISO: U_jetson-nano/U_isolation_0 (U1_U_isolation_0.14), U_bob_0 (J6_U_bob_0.2), U_bob_1 (J6_U_bob_1.2), U_bob_2 (J6_U_bob_2.2), U_bob_3 (J6_U_bob_3.2), U_bob_4 (J6_U_bob_4.2)
SPI_1_MISO: jetson-nano (J1.21), U_jetson-nano/U_isolation_0 (U1_U_isolation_0.13), ui (J9.21)
SPI_1_MISO_FILTER: U_jetson-nano/U_isolation_0 (U1_U_isolation_0.11), U_jetson-nano/U_low-pass-filter_3 (R13_U_low-pass-filter_3.1 R14_U_low-pass-filter_3.1)
SPI_1_MISO_ISO: U_jetson-nano/U_low-pass-filter_3 (R12_U_low-pass-filter_3.2), U_bob_0 (J6_U_bob_0.5), U_bob_1 (J6_U_bob_1.5), U_bob_2 (J6_U_bob_2.5), U_bob_3 (J6_U_bob_3.5), U_bob_4 (J6_U_bob_4.5)
SPI_1_MOSI: jetson-nano (J1.19), U_jetson-nano/U_low-pass-filter_2 (R12_U_low-pass-filter_2.2), ui (J9.19)
SPI_1_MOSI_FILTER: U_jetson-nano/U_isolation_0 (U1_U_isolation_0.5), U_jetson-nano/U_low-pass-filter_2 (R13_U_low-pass-filter_2.1 R14_U_low-pass-filter_2.1)
SPI_1_MOSI_ISO: U_jetson-nano/U_isolation_0 (U1_U_isolation_0.12), U_bob_0 (J6_U_bob_0.4), U_bob_1 (J6_U_bob_1.4), U_bob_2 (J6_U_bob_2.4), U_bob_3 (J6_U_bob_3.4), U_bob_4 (J6_U_bob_4.4)
SPI_1_SCK: jetson-nano (J1.23), U_jetson-nano/U_low-pass-filter_1 (R12_U_low-pass-filter_1.2), ui (J9.23)
SPI_1_SCK_FILTER: U_jetson-nano/U_isolation_0 (U1_U_isolation_0.4), U_jetson-nano/U_low-pass-filter_1 (R13_U_low-pass-filter_1.1 R14_U_low-pass-filter_1.1)
SPI_1_SCK_ISO: U_jetson-nano/U_isolation_0 (U1_U_isolation_0.6), U_bob_0 (J6_U_bob_0.3), U_bob_1 (J6_U_bob_1.3), U_bob_2 (J6_U_bob_2.3), U_bob_3 (J6_U_bob_3.3), U_bob_4 (J6_U_bob_4.3)
SPI_2_CS0: jetson-nano (J1.18), ui (J9.18)
SPI_2_CS1: jetson-nano (J1.16), ui (J9.16)
SPI_2_MISO: jetson-nano (J1.22), ui (J9.22)
SPI_2_MOSI: jetson-nano (J1.37), ui (J9.37)
SPI_2_SCK: jetson-nano (J1.13), ui (J9.13)
UART_2_CTS: jetson-nano (J1.36), ui (J9.36)
UART_2_RTS: jetson-nano (J1.11), ui (J9.11)
UART_2_RX: jetson-nano (J1.10), power (J3.3 UART_RX.1), ui (J9.10)
UART_2_TX: jetson-nano (J1.08), power (J3.2 UART_TX.1), ui (J9.08)